# EAGLE schematic WiiSPii_Rev1.4 (EAGLE 9.6.2)

## Sheet 1 of 4: BQ25895M
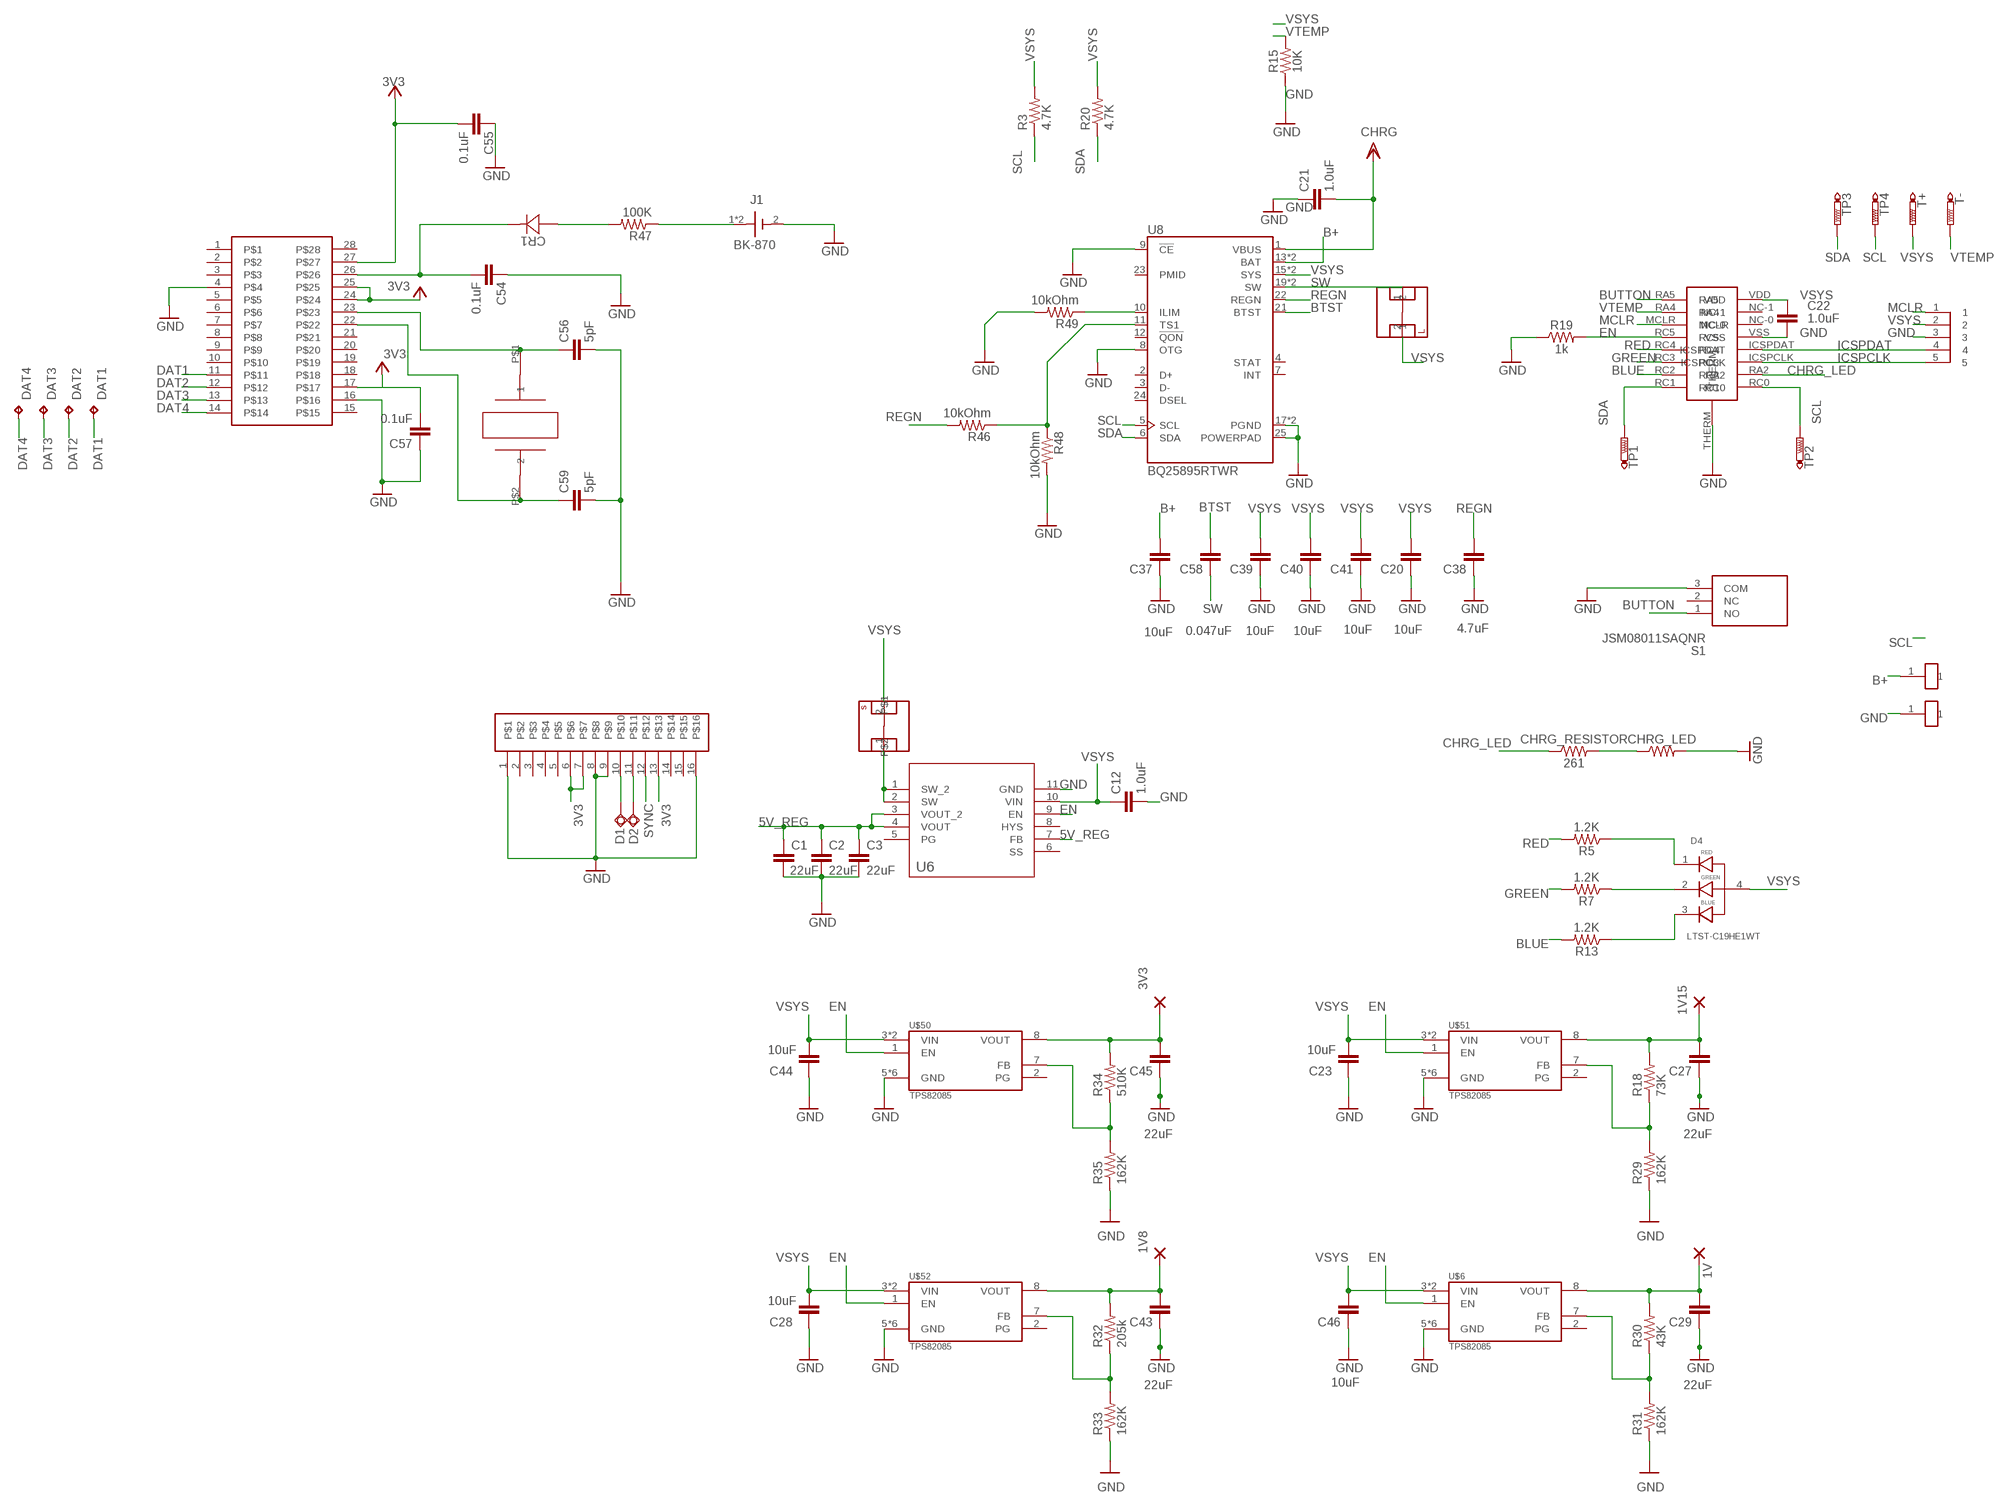
[diagram p0: schematic, sheet 1]

### Parts
1V  SMD2  [SMD1,27-2,54]
1V8  SMD2  [SMD1,27-2,54]
1V15  SMD2  [SMD1,27-2,54]
3V3  SMD2  [SMD1,27-2,54]
BT_DATA1  TPSQB1,27  [B1,27]
BT_DATA2  TPSQB1,27  [B1,27]
C1  22uF  1.0UF-0805-25V-(+80/-20%)  [0805]
C2  22uF  1.0UF-0805-25V-(+80/-20%)  [0805]
C3  22uF  1.0UF-0805-25V-(+80/-20%)  [0805]
C12  1.0uF  1.0UF-0805-25V-(+80/-20%)  [0805]
C20  10uF  1.0UF-0805-25V-(+80/-20%)  [0805]
C21  1.0uF  1.0UF-0805-25V-(+80/-20%)  [0805]
C22  1.0uF  1.0UF-0805-25V-(+80/-20%)  [0805]
C23  10uF  1.0UF-0805-25V-(+80/-20%)  [0805]
C27  22uF  1.0UF-0805-25V-(+80/-20%)  [0805]
C28  10uF  1.0UF-0805-25V-(+80/-20%)  [0805]
C29  22uF  1.0UF-0805-25V-(+80/-20%)  [0805]
C37  10uF  1.0UF-0805-25V-(+80/-20%)  [0805]
C38  4.7uF  C-EUC0402  [C0402]
C39  10uF  1.0UF-0805-25V-(+80/-20%)  [0805]
C40  10uF  1.0UF-0805-25V-(+80/-20%)  [0805]
C41  10uF  1.0UF-0805-25V-(+80/-20%)  [0805]
C43  22uF  1.0UF-0805-25V-(+80/-20%)  [0805]
C44  10uF  1.0UF-0805-25V-(+80/-20%)  [0805]
C45  22uF  1.0UF-0805-25V-(+80/-20%)  [0805]
C46  10uF  1.0UF-0805-25V-(+80/-20%)  [0805]
C54  0.1uF  C-EUC0402  [C0402]
C55  0.1uF  C-EUC0402  [C0402]
C56  5pF  C-EUC0402  [C0402]
C57  0.1uF  C-EUC0402  [C0402]
C58  0.047uF  C-EUC0402  [C0402]
C59  5pF  C-EUC0402  [C0402]
CHRG_LED  261  1KOHM-0603-1/10W-1%  [0603]
CHRG_RESISTOR  261  1KOHM-0603-1/10W-1%  [0603]
CR1  BAT60JFILM  [SOD-323_STM]
D4  LTST-C19HE1WT  [LED_LTST-C19HE1WT]
DAT1  TPB1,27  [B1,27]
DAT2  TPB1,27  [B1,27]
DAT3  TPB1,27  [B1,27]
DAT4  TPB1,27  [B1,27]
J1  BK-870  [MPD_BK-870]
R3  4.7K  R-US_R0402  [R0402]
R5  1.2K  1KOHM-0603-1/10W-1%  [0603]
R7  1.2K  1KOHM-0603-1/10W-1%  [0603]
R13  1.2K  1KOHM-0603-1/10W-1%  [0603]
R15  10K  1KOHM-0603-1/10W-1%  [0603]
R18  73K  R-US_R0402  [R0402]
R19  1k  1KOHM-0603-1/10W-1%  [0603]
R20  4.7K  R-US_R0402  [R0402]
R29  162K  R-US_R0402  [R0402]
R30  43K  R-US_R0402  [R0402]
R31  162K  R-US_R0402  [R0402]
R32  205k  R-US_R0402  [R0402]
R33  162K  R-US_R0402  [R0402]
R34  510K  R-US_R0402  [R0402]
R35  162K  R-US_R0402  [R0402]
R46  10kOhm  R-US_R0402  [R0402]
R47  100K  R-US_R0402  [R0402]
R48  10kOhm  R-US_R0402  [R0402]
R49  10kOhm  R-US_R0402  [R0402]
S1  JSM08011SAQNR  [JSM08011SAQNR]
T+  PTR1TP09R  [TP09R]
T-  PTR1TP09R  [TP09R]
TP1  PTR1TP09R  [TP09R]
TP2  PTR1TP09R  [TP09R]
TP3  PTR1TP09R  [TP09R]
TP4  PTR1TP09R  [TP09R]
U6  TPS61232DRCR  [DRC_S-PVSON-N10]
U8  BQ25895RTWR  [VQFN50P400X400X100-24N]
U$2  INDUCTOR_SMALL  [INDUCTOR_SMALL]
U$6  TPS82085  [SON65P280X300X133-9N]
U$7  AUDIO_AMP_PIC  [AUDIO_AMP_PIC]
U$8  1MM_PIC_PROGRAMING_HEADER  [1MM_PIC-PROGRAMING_HEADER]
U$13  MOLEX_0541020164MOLEX  [MOLEX_0541020164MOLEX]
U$14  MX_WII  [MX_WII]
U$15  TFE20  [TFE20]
U$27  VOLTAGE_PAD  [VOLTAGE_PAD]
U$28  VOLTAGE_PAD  [VOLTAGE_PAD]
U$49  INDUCTOR_LARGE  [INDUCTOR_BIG]
U$50  TPS82085  [SON65P280X300X133-9N]
U$51  TPS82085  [SON65P280X300X133-9N]
U$52  TPS82085  [SON65P280X300X133-9N]

### Nets
1V: 1V.1(P) C29.2 R30.2 U$6.8(VOUT)
1V8: 1V8.1(P) C43.2 R32.2 U$52.8(VOUT) ; also sheet 2
1V15: 1V15.1(P) C27.2 R18.2 U$51.8(VOUT)
3V3: 3V3.1(P) C45.2 C55.2 C57.2 R34.2 U$13.6 U$13.7 U$13.13 U$14.17 U$14.24 U$14.25 U$14.27 U$50.8(VOUT) ; supply symbol labelled VCC ; also sheet 2,4
5V_REG: C1.1 C2.1 C3.1 U6.3(VOUT_2) U6.4(VOUT) U6.7(FB) ; also sheet 3,4
B+: C37.2 U8.13(BAT) U8.14(BAT) U$28.1
BLUE: R13.2 U$7.RC2
BTST: C58.2 U8.21(BTST)
BUTTON: S1.1(NO) U$7.RA5
CHRG: C21.2 U8.1(VBUS) ; supply symbol labelled VDD ; also sheet 3
CHRG_LED: CHRG_RESISTOR.1 U$7.RA2
D1: BT_DATA1.TP U$13.10
D2: BT_DATA2.TP U$13.11
DAT1: DAT1.TP U$14.11
DAT2: DAT2.TP U$14.12
DAT3: DAT3.TP U$14.13
DAT4: DAT4.TP U$14.14
EN: R19.2 U6.9(EN) U$6.1(EN) U$7.RC5 U$50.1(EN) U$51.1(EN) U$52.1(EN)
GND: C1.2 C2.2 C3.2 C12.2 C20.1 C21.1 C22.2 C23.1 C27.1 C28.1 C29.1 C37.1 C38.1 C39.1 C40.1 C41.1 C43.1 C44.1 C45.1 C46.1 C54.1 C55.1 C56.2 C57.1 C59.2 CHRG_LED.2 J1.2(M) R15.1 R19.1 R29.1 R31.1 R33.1 R35.1 R48.2 R49.2 S1.3(COM) U6.11(GND) U8.8(OTG) U8.9(!CE) U8.17(PGND) U8.18(PGND) U8.25(POWERPAD) U$6.5(GND) U$6.6(GND) U$6.9(GND) U$6.P$1(GND) U$6.P$2(GND) U$6.P$3(GND) U$7.THERM U$7.VSS U$8.3 U$13.1 U$13.8 U$13.9 U$13.16 U$14.4 U$14.16 U$27.1 U$50.5(GND) U$50.6(GND) U$50.9(GND) U$50.P$1(GND) U$50.P$2(GND) U$50.P$3(GND) U$51.5(GND) U$51.6(GND) U$51.9(GND) U$51.P$1(GND) U$51.P$2(GND) U$51.P$3(GND) U$52.5(GND) U$52.6(GND) U$52.9(GND) U$52.P$1(GND) U$52.P$2(GND) U$52.P$3(GND) ; also sheet 2,3,4
GREEN: R7.2 U$7.RC3
ICSPCLK: U$7.ICSPCLK U$8.5
ICSPDAT: U$7.ICSPDAT U$8.4
MCLR: U$7.MCLR U$8.1
N$3: U6.1(SW_2) U6.2(SW) U$2.1
N$5: D4.2 R7.1
N$11: D4.1 R5.1
N$12: D4.3 R13.1
N$13: CHRG_LED.1 CHRG_RESISTOR.2
N$14: C56.1 U$14.23 U$15.P$1
N$15: C59.1 U$14.22 U$15.P$2
N$19: CR1.2 R47.2
N$27: R18.1 R29.2 U$51.7(FB)
N$28: R46.1 R48.1 U8.11(TS1)
N$29: R49.1 U8.10(ILIM)
N$34: C54.2 CR1.1 U$14.26
N$36: J1.1(P) J1.3(P) R47.1
N$53: R30.1 R31.2 U$6.7(FB)
N$55: R32.1 R33.2 U$52.7(FB)
N$57: R34.1 R35.2 U$50.7(FB)
RED: R5.2 U$7.RC4
REGN: C38.2 R46.2 U8.22(REGN)
SCL: R3.1 TP2.TP TP4.TP U8.5(SCL) U$7.RC0 ; also sheet 3
SDA: R20.1 TP1.TP TP3.TP U8.6(SDA) U$7.RC1 ; also sheet 3
SW: C58.1 U8.19(SW) U8.20(SW) U$49.1
SYNC: U$13.12 ; also sheet 4
VSYS: C12.1 C20.2 C22.1 C23.2 C28.2 C39.2 C40.2 C41.2 C44.2 C46.2 D4.4 R3.2 R20.2 T+.TP U6.10(VIN) U8.15(SYS) U8.16(SYS) U$2.2 U$6.3(VIN) U$6.4(VIN) U$7.VDD U$8.2 U$49.2 U$50.3(VIN) U$50.4(VIN) U$51.3(VIN) U$51.4(VIN) U$52.3(VIN) U$52.4(VIN) ; also sheet 3
VTEMP: R15.2 T-.TP U$7.RA4
Unconnected: S1.2(NC) U6.5(PG) U6.6(SS) U6.8(HYS) U8.2(D+) U8.3(D-) U8.4(STAT) U8.7(INT) U8.12(!QON) U8.23(PMID) U8.24(DSEL) U$6.2(PG) U$7.NC-0 U$7.NC-1 U$13.2 U$13.3 U$13.4 U$13.5 U$13.14 U$13.15 U$14.1 U$14.2 U$14.3 U$14.5 U$14.6 U$14.7 U$14.8 U$14.9 U$14.10 U$14.15 U$14.18 U$14.19 U$14.20 U$14.21 U$14.28 U$50.2(PG) U$51.2(PG) U$52.2(PG)

## Sheet 2 of 4: LM49450
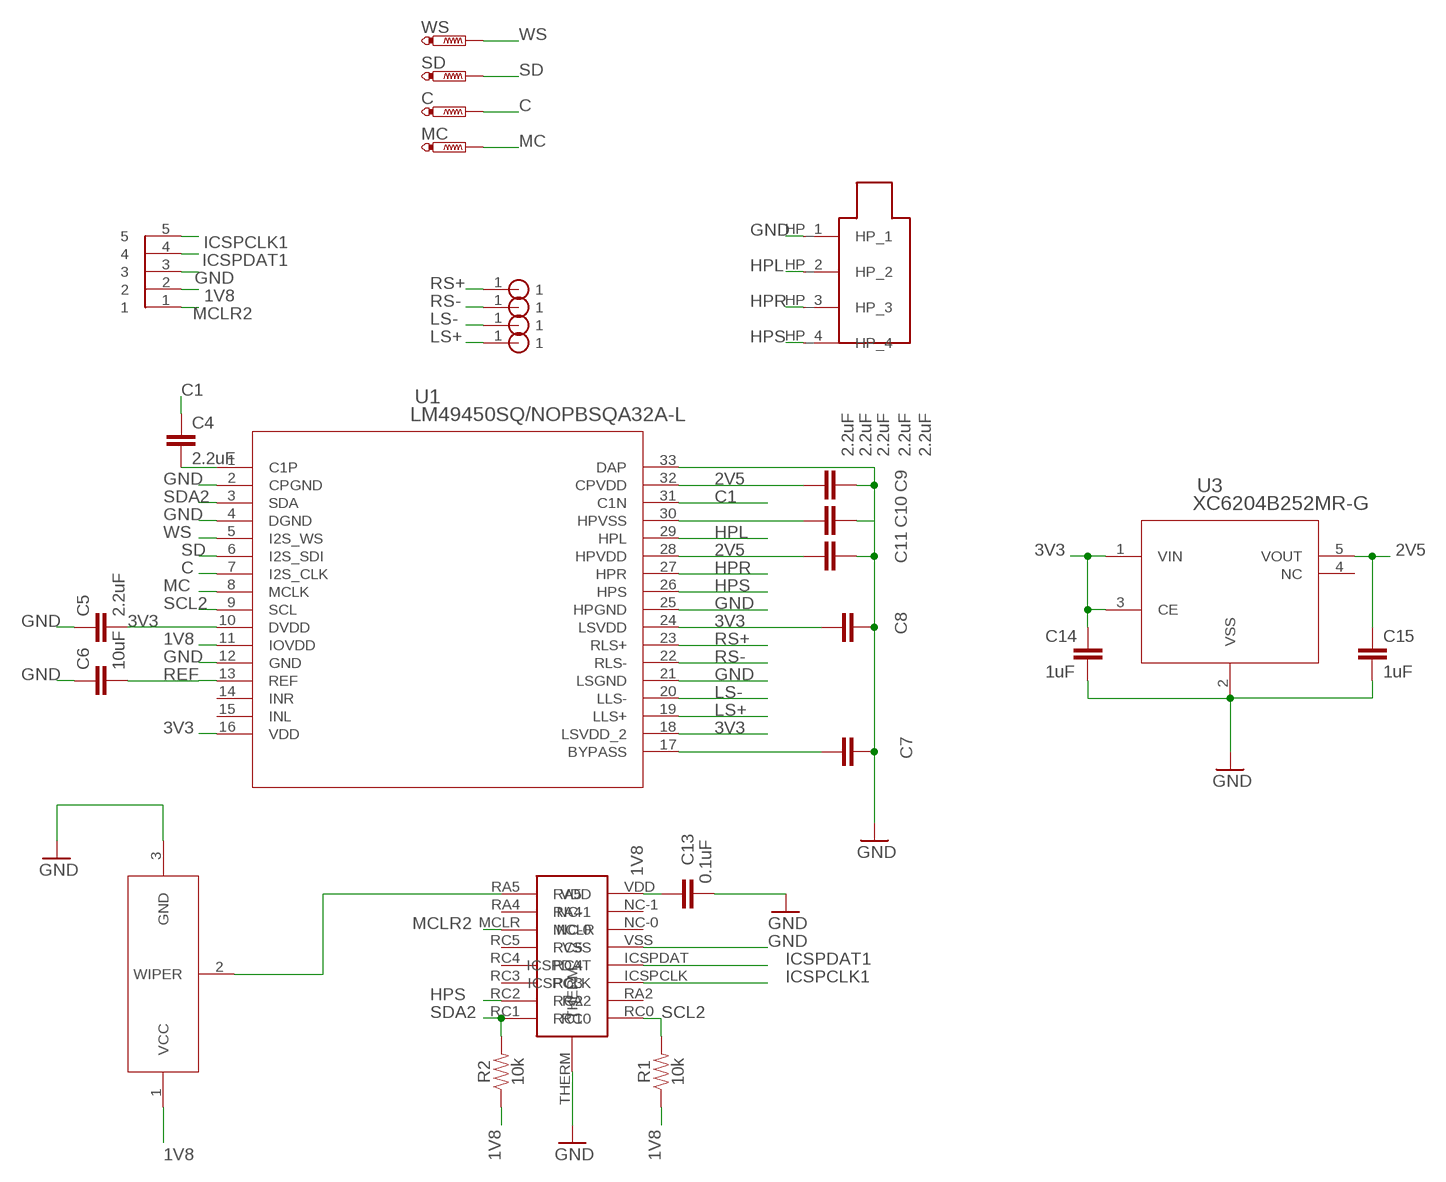
[diagram p1: schematic, sheet 2]

### Parts
C  PTR1TP09R  [TP09R]
C4  2.2uF  0.1UF-0603-100V-10%  [0603]
C5  2.2uF  0.1UF-0603-100V-10%  [0603]
C6  10uF  0.1UF-0603-100V-10%  [0603]
C7  2.2uF  0.1UF-0603-100V-10%  [0603]
C8  2.2uF  0.1UF-0603-100V-10%  [0603]
C9  2.2uF  0.1UF-0603-100V-10%  [0603]
C10  2.2uF  0.1UF-0603-100V-10%  [0603]
C11  2.2uF  0.1UF-0603-100V-10%  [0603]
C13  0.1uF  0.1UF-0603-100V-10%  [0603]
C14  1uF  0.1UF-0603-100V-10%  [0603]
C15  1uF  0.1UF-0603-100V-10%  [0603]
MC  PTR1TP09R  [TP09R]
R1  10k  1KOHM-0603-1/10W-1%  [0603]
R2  10k  1KOHM-0603-1/10W-1%  [0603]
RS+  WII_VIA  [WII_VIA]
SD  PTR1TP09R  [TP09R]
U1  LM49450SQ/NOPBSQA32A-L  [SQA32A-L]
U3  XC6204B252MR-G  [XC6204/05_SOT-25]
U$1  AUDIO_AMP_PIC  [AUDIO_AMP_PIC]
U$3  1MM_PIC_PROGRAMING_HEADER  [1MM_PIC-PROGRAMING_HEADER]
U$9  RK10J11R001Y  [RK10J11R001Y]
U$40  WII_VIA  [WII_VIA]
U$41  WII_VIA  [WII_VIA]
U$42  WII_VIA  [WII_VIA]
U$44  HP_JACK  [HP_JACK]
WS  PTR1TP09R  [TP09R]

### Nets
1V8: C13.1 R1.1 R2.1 U1.11(IOVDD) U$1.VDD U$3.2 U$9.1(VCC) ; also sheet 1
2V5: C9.1 C11.1 C15.1 U1.28(HPVDD) U1.32(CPVDD) U3.5(VOUT)
3V3: C5.2 C8.2 C14.1 U1.10(DVDD) U1.16(VDD) U1.18(LSVDD_2) U1.24(LSVDD) U3.1(VIN) U3.3(CE) ; also sheet 1,4
C: C.TP U1.7(I2S_CLK)
C1: C4.1 U1.31(C1N)
GND: C5.1 C6.1 C7.1 C8.1 C9.2 C10.2 C11.2 C13.2 C14.2 C15.2 U1.2(CPGND) U1.4(DGND) U1.12(GND) U1.21(LSGND) U1.25(HPGND) U1.33(DAP) U3.2(VSS) U$1.THERM U$1.VSS U$3.3 U$9.3(GND) U$44.HP_1 ; also sheet 1,3,4
HPL: U1.29(HPL) U$44.HP_2
HPR: U1.27(HPR) U$44.HP_3
HPS: U1.26(HPS) U$1.RC2 U$44.HP_4
ICSPCLK1: U$1.ICSPCLK U$3.5
ICSPDAT1: U$1.ICSPDAT U$3.4
LS+: U1.19(LLS+) U$42.1
LS-: U1.20(LLS-) U$41.1
MC: MC.TP U1.8(MCLK)
MCLR2: U$1.MCLR U$3.1
N$1: C7.2 U1.17(BYPASS)
N$30: C10.1 U1.30(HPVSS)
N$35: U$1.RA5 U$9.2(WIPER)
PIN1: C4.2 U1.1(C1P)
REF: C6.2 U1.13(REF)
RS+: RS+.1 U1.23(RLS+)
RS-: U1.22(RLS-) U$40.1
SCL2: R1.2 U1.9(SCL) U$1.RC0
SD: SD.TP U1.6(I2S_SDI)
SDA2: R2.2 U1.3(SDA) U$1.RC1
WS: U1.5(I2S_WS) WS.TP
Unconnected: U1.14(INR) U1.15(INL) U3.4(NC) U$1.NC-0 U$1.NC-1 U$1.RA2 U$1.RA4 U$1.RC3 U$1.RC4 U$1.RC5

## Sheet 3 of 4: STUBS4500
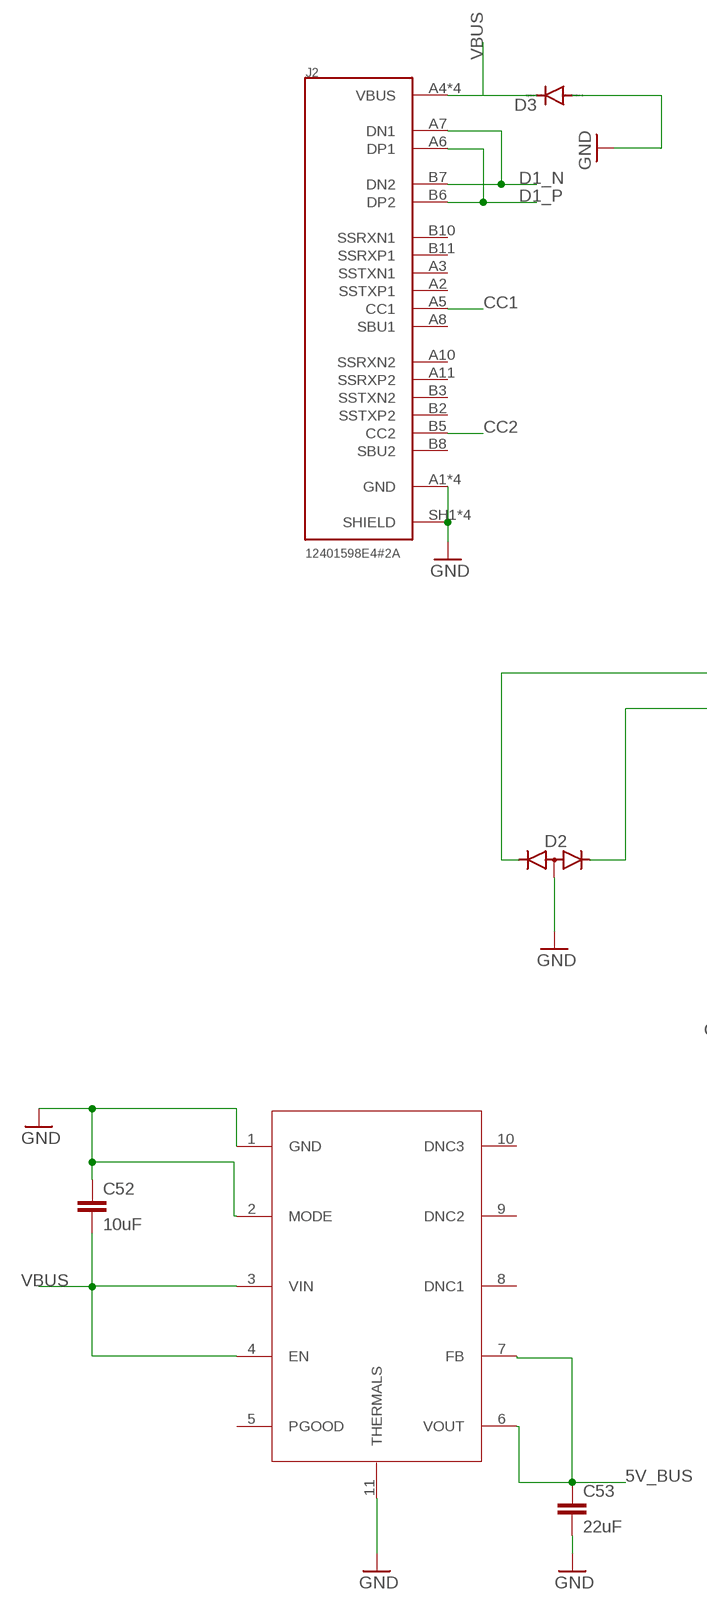
[diagram p2: schematic, sheet 3, part 1 of 2]
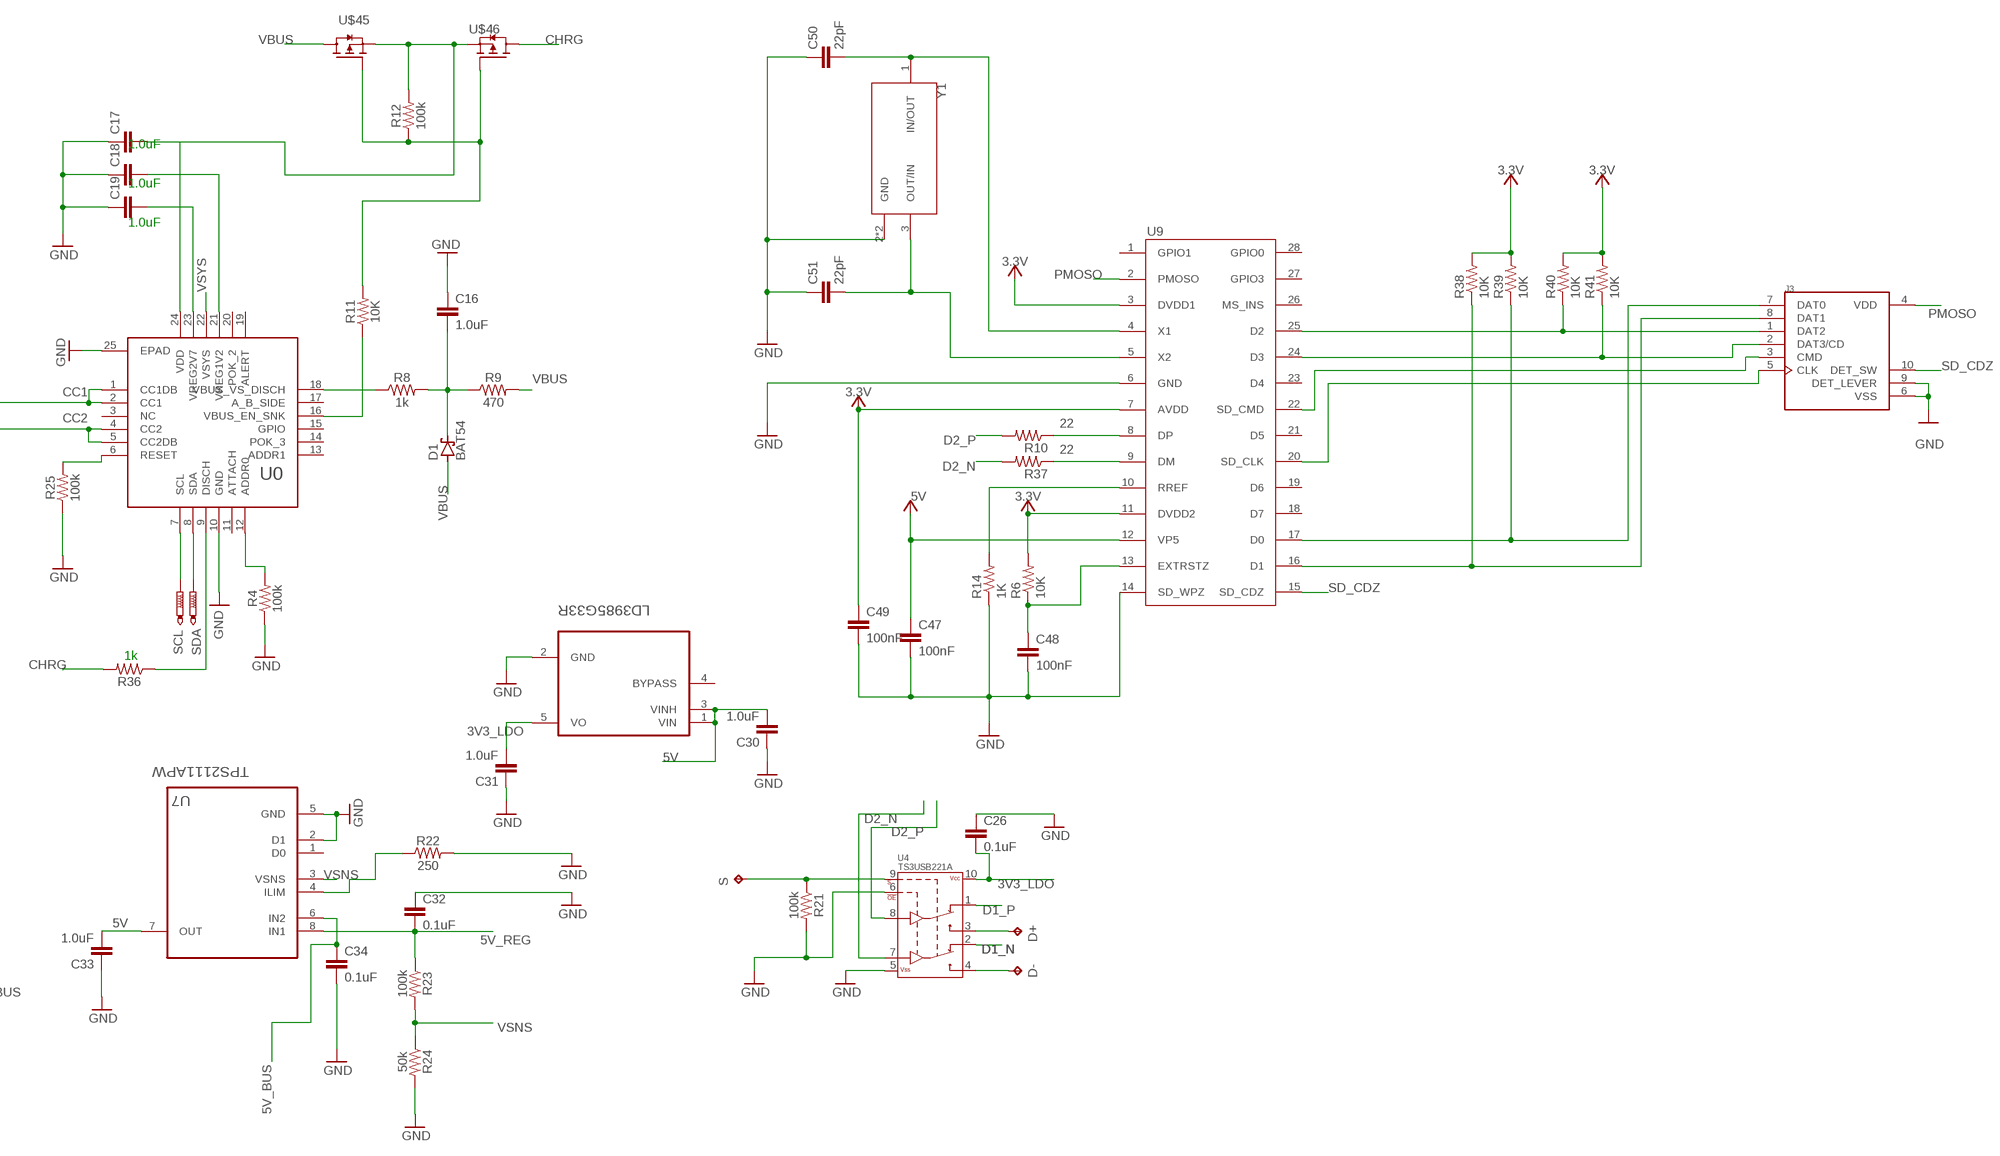
[diagram p3: schematic, sheet 3, part 2 of 2]

### Parts
C16  1.0uF  1.0UF-0603-16V-10%  [0603]
C17  1.0uF  1.0UF-0603-16V-10%  [0603]
C18  1.0uF  1.0UF-0603-16V-10%  [0603]
C19  1.0uF  1.0UF-0603-16V-10%  [0603]
C26  0.1uF  0.1UF-0603-25V-(+80/-20%)  [0603]
C30  1.0uF  1.0UF-0603-16V-10%  [0603]
C31  1.0uF  1.0UF-0603-16V-10%  [0603]
C32  0.1uF  0.1UF-0603-25V-(+80/-20%)  [0603]
C33  1.0uF  1.0UF-0603-16V-10%  [0603]
C34  0.1uF  0.1UF-0603-25V-(+80/-20%)  [0603]
C47  100nF  C-EUC0402  [C0402]
C48  100nF  C-EUC0402  [C0402]
C49  100nF  C-EUC0402  [C0402]
C50  22pF  C-EUC0402  [C0402]
C51  22pF  C-EUC0402  [C0402]
C52  10uF  22UF-1210-16V-20%  [1210]
C53  22uF  22UF-1210-16V-20%  [1210]
D1  BAT54  [SOT23]
D2  ESDA25W  [SOT65P210X110-3N]
D3  ESDA25P35-1U1M  [ESDA8P801U1M]
D+  TPB1,27  [B1,27]
D-  TPB1,27  [B1,27]
J2  12401598E4#2A  [AMPHENOL_12401598E4#2A]
J3  5025700893  [MOLEX_5025700893]
R4  100k  100KOHM-0603-1/10W-1%  [0603]
R6  10K  R-US_R0402  [R0402]
R8  1k  1KOHM-0603-1/10W-1%  [0603]
R9  470  470OHM-0603-1/10W-1%  [0603]
R10  22  R-US_R0402  [R0402]
R11  10K  22KOHM-0603-1/10W-1%  [0603]
R12  100k  100KOHM-0603-1/10W-1%  [0603]
R14  1K  R-US_R0402  [R0402]
R21  100k  100KOHM-0603-1/10W-1%  [0603]
R22  250  240OHM-0603-1/10W-1%  [0603]
R23  100k  240OHM-0603-1/10W-1%  [0603]
R24  50k  240OHM-0603-1/10W-1%  [0603]
R25  100k  100KOHM-0603-1/10W-1%  [0603]
R36  1K  100KOHM-0603-1/10W-1%  [0603]
R37  22  R-US_R0402  [R0402]
R38  10K  R-US_R0402  [R0402]
R39  10K  R-US_R0402  [R0402]
R40  10K  R-US_R0402  [R0402]
R41  10K  R-US_R0402  [R0402]
S  TPB1,27  [B1,27]
SCL  PTR1TP09R  [TP09R]
SDA  PTR1TP09R  [TP09R]
U0  STUSB4500  [QFN50P440X440X100-25T255]
U4  TS3USB221A  [QFN-10-RSE]
U5  LD3985G33R  [SOT95P280X145-5N]
U7  TPS2111APW  [SOP65P640X120-8N]
U9  GL82L_SSOP  [GL827L_SSOP]
U$10  LMZM23601  [MODULE_LMZM23600SILR]
U$45  STL6P3LLH6  [POWERFLAT_3.3X3.3]
U$46  STL6P3LLH6  [POWERFLAT_3.3X3.3]
Y1  ECS-120-13-30B-AEM-TR  [XTAL_ECS-120-13-30B-AEM-TR]

### Nets
3.3V: C49.1 R6.2 R38.2 R39.2 R40.2 R41.2 U9.3(DVDD1) U9.7(AVDD) U9.11(DVDD2) ; supply symbol labelled VCC
3V3_LDO: C26.2 C31.2 U4.10(VCC) U5.5(VO)
5V: C30.2 C33.2 C47.1 U5.1(VIN) U5.3(VINH) U7.7(OUT) U9.12(VP5) ; supply symbol labelled VCC
5V_BUS: C34.1 C53.1 U7.6(IN2) U$10.6(VOUT) U$10.7(FB)
5V_REG: C32.2 R23.1 U7.8(IN1) ; also sheet 1,4
CC1: D2.1(K2) J2.A5(CC1) U0.1(CC1DB) U0.2(CC1)
CC2: D2.2(K1) J2.B5(CC2) U0.4(CC2) U0.5(CC2DB)
CHRG: R36.2 U$46.5(D) U$46.6(D) U$46.7(D) ; also sheet 1
D1_N [USB 2.0 Differential Pair]: J2.A7(DN1) J2.B7(DN2) U4.2(1D-)
D1_P [USB 2.0 Differential Pair]: J2.A6(DP1) J2.B6(DP2) U4.1(1D+)
D2_N [USB 2.0 Differential Pair]: R37.2 U4.7(D-)
D2_P [USB 2.0 Differential Pair]: R10.2 U4.8(D+)
GND: C16.1 C17.1 C18.1 C19.1 C26.1 C30.1 C31.1 C32.1 C33.1 C34.2 C47.2 C48.2 C49.2 C50.1 C51.1 C52.1 C53.2 D2.3(A) D3.1(A) J2.A1(GND) J2.A12(GND) J2.B1(GND) J2.B12(GND) J2.SH1(SHIELD) J2.SH2(SHIELD) J2.SH3(SHIELD) J2.SH4(SHIELD) J3.6(VSS) J3.9(DET_LEVER) R4.1 R14.1 R21.2 R22.2 R24.2 R25.1 U0.10(GND) U0.25(EPAD) U4.5(VSS) U4.6(!OE) U5.2(GND) U7.2(D1) U7.5(GND) U9.6(GND) U9.14(SD_WPZ) U$10.1(GND) U$10.2(MODE) U$10.11(THERMALS) Y1.2(GND) Y1.4(GND) ; also sheet 1,2,4
N$6: R4.2 U0.12(ADDR0)
N$7: R8.1 U0.18(VBUS_VS_DISCH)
N$8: C19.2 U0.23(VREG2V7)
N$9: R11.1 U0.16(VBUS_EN_SNK)
N$10: R11.2 R12.1 U$45.4(G) U$46.4(G)
N$16: R36.1 U0.9(DISCH)
N$20: R21.1 S.TP U4.9(S)
N$21: D-.TP U4.4(2D-)
N$22: D+.TP U4.3(2D+)
N$23: R22.1 U7.4(ILIM)
N$24: R25.2 U0.6(RESET)
N$25: C18.2 U0.21(VREG1V2)
N$26: C16.2 D1.3(C) R8.2 R9.1
N$31: C48.1 R6.1 U9.13(EXTRSTZ)
N$52: R14.2 U9.10(RREF)
N$54: R10.1 U9.8(DP)
N$56: R37.1 U9.9(DM)
N$68: C50.2 U9.4(X1) Y1.1(IN/OUT)
N$69: J3.1(DAT2) R40.1 U9.25(D2)
N$70: J3.2(DAT3/CD) R41.1 U9.24(D3)
N$71: J3.3(CMD) U9.22(SD_CMD)
N$73: J3.5(CLK) U9.20(SD_CLK)
N$74: J3.8(DAT1) R38.1 U9.16(D1)
N$75: J3.7(DAT0) R39.1 U9.17(D0)
N$76: C51.2 U9.5(X2) Y1.3(OUT/IN)
PMOSO: J3.4(VDD) U9.2(PMOSO)
SCL: SCL.TP U0.7(SCL) ; also sheet 1
SD_CDZ: J3.10(DET_SW) U9.15(SD_CDZ)
SDA: SDA.TP U0.8(SDA) ; also sheet 1
VBUS: C52.2 D1.1(A) D3.2(C) J2.A4(VBUS) J2.A9(VBUS) J2.B4(VBUS) J2.B9(VBUS) R9.2 U$10.3(VIN) U$10.4(EN) U$45.5(D) U$45.6(D) U$45.7(D)
VCC: C17.2 R12.2 U0.24(VDD) U$45.1(S) U$45.2(S) U$45.3(S) U$46.1(S) U$46.2(S) U$46.3(S) ; also sheet 1
VSNS: R23.2 R24.1 U7.3(VSNS)
VSYS: U0.22(VSYS) ; also sheet 1
Unconnected: J2.A2(SSTXP1) J2.A3(SSTXN1) J2.A8(SBU1) J2.A10(SSRXN2) J2.A11(SSRXP2) J2.B2(SSTXP2) J2.B3(SSTXN2) J2.B8(SBU2) J2.B10(SSRXN1) J2.B11(SSRXP1) U0.3(NC) U0.11(ATTACH) U0.13(ADDR1) U0.14(POK_3) U0.15(GPIO) U0.17(A_B_SIDE) U0.19(ALERT) U0.20(POK_2) U5.4(BYPASS) U7.1(D0) U9.1(GPIO1) U9.18(D7) U9.19(D6) U9.21(D5) U9.23(D4) U9.26(MS_INS) U9.27(GPIO3) U9.28(GPIO0) U$10.5(PGOOD) U$10.8(DNC1) U$10.9(DNC2) U$10.10(DNC3)

### Notes on the sheet
- 1.0uF
- 1.0uF
- 1.0uF
- 1k

## Sheet 4 of 4: GC+ 2.0
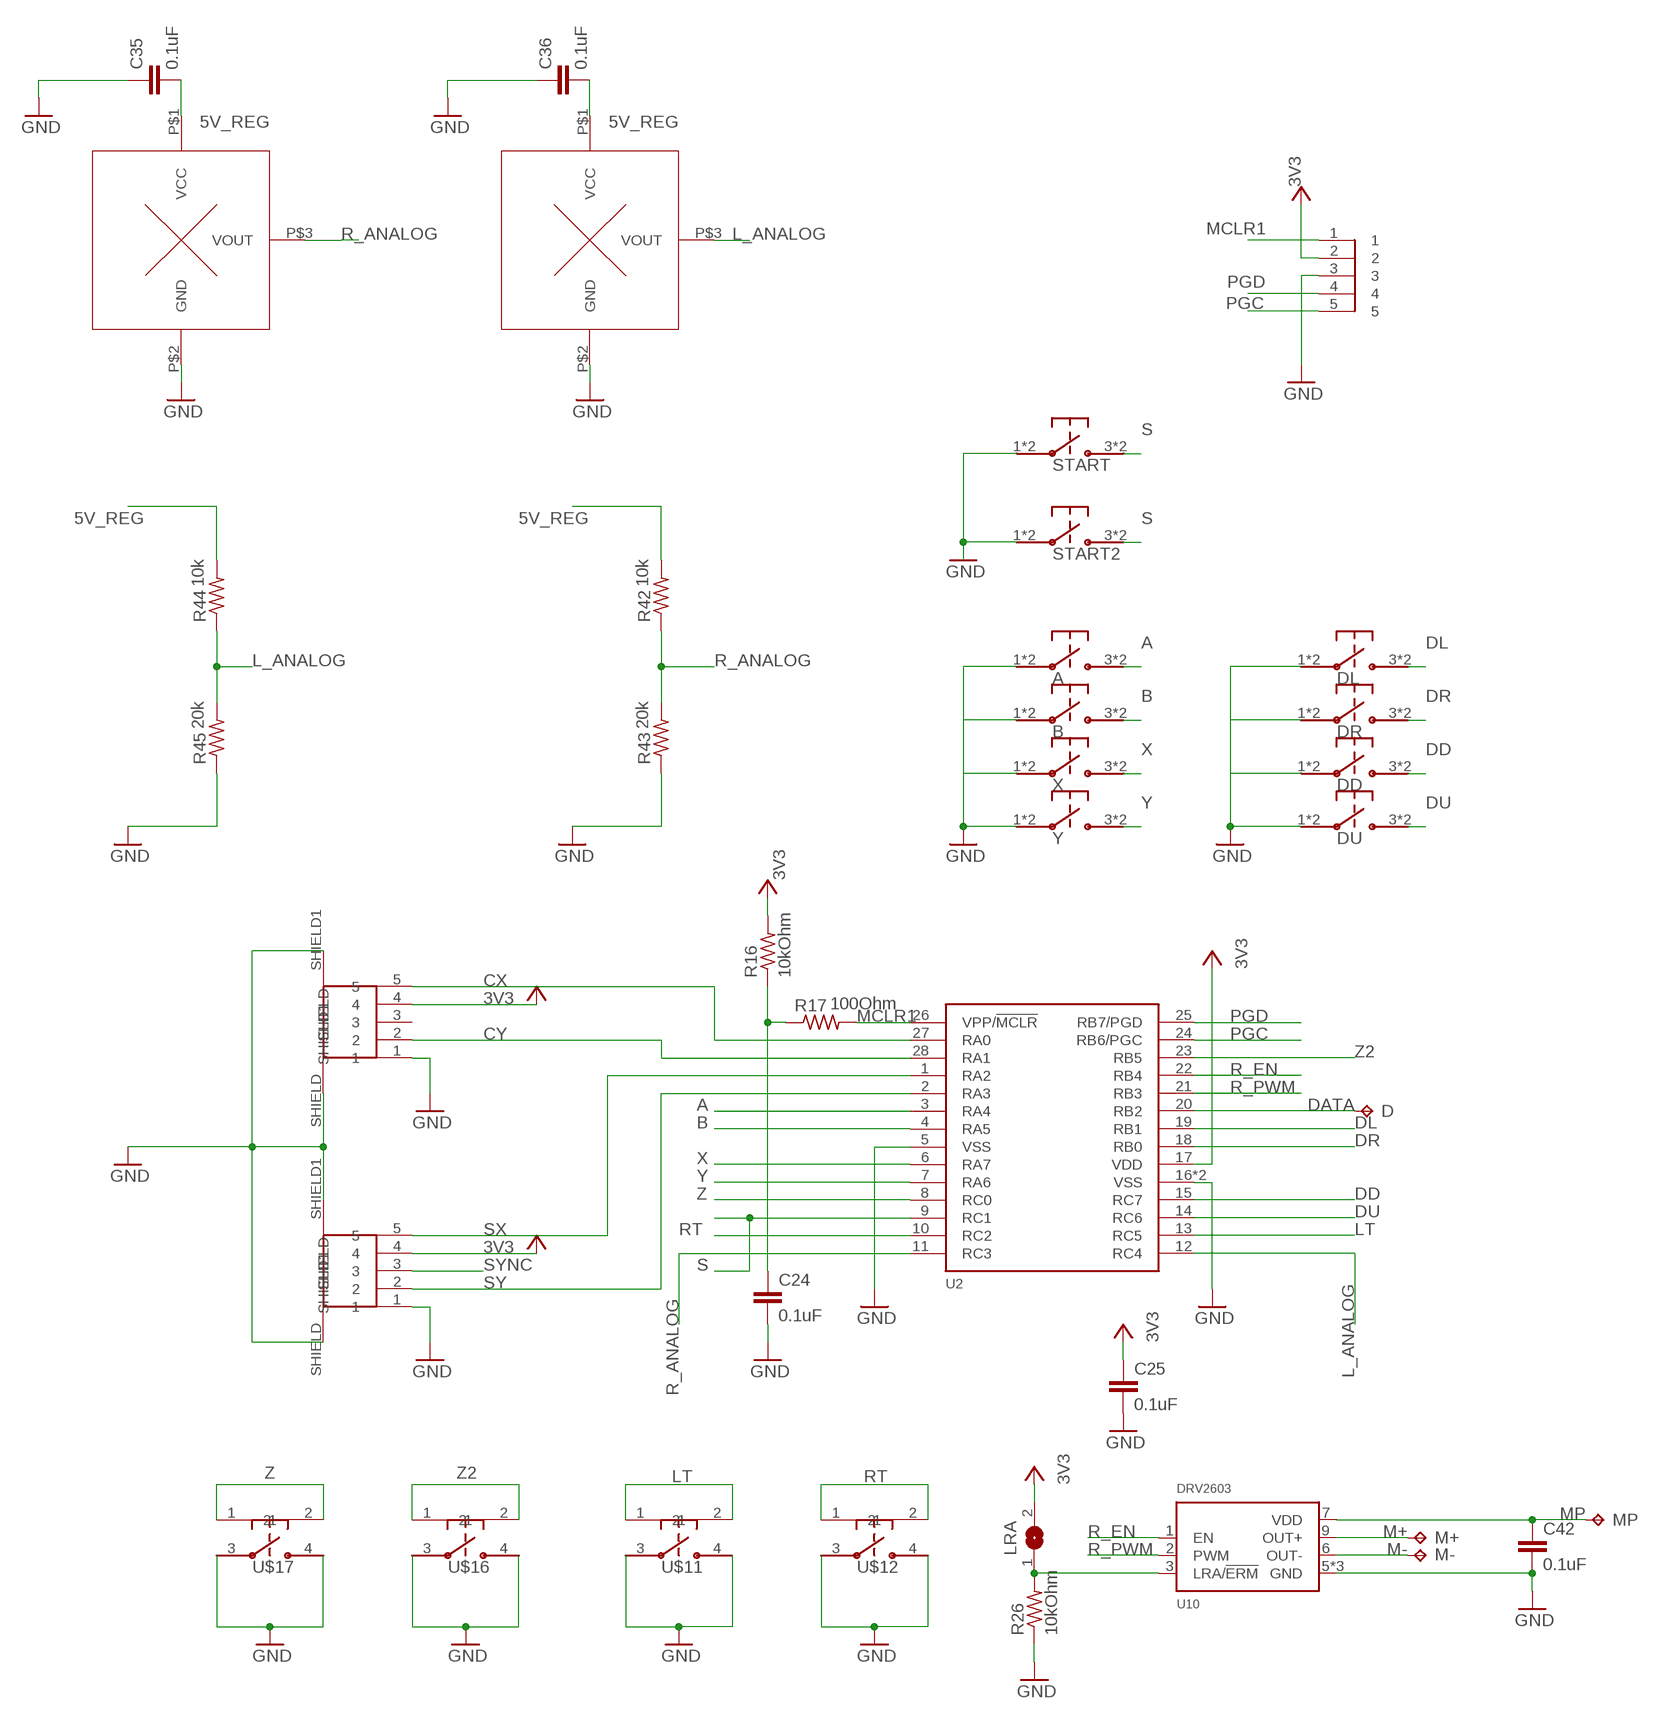
[diagram p4: schematic, sheet 4]

### Parts
A  TL3315NF100Q  [TL3315NF100Q]
B  TL3315NF100Q  [TL3315NF100Q]
C24  0.1uF  C-EUC0402  [C0402]
C25  0.1uF  C-EUC0402  [C0402]
C35  0.1uF  C-EUC0402  [C0402]
C36  0.1uF  C-EUC0402  [C0402]
C42  0.1uF  C-EUC0402  [C0402]
DATA  TPTP10SQ  [TP10SQ]
DD  TL3315NF100Q  [TL3315NF100Q]
DL  TL3315NF100Q  [TL3315NF100Q]
DR  TL3315NF100Q  [TL3315NF100Q]
DU  TL3315NF100Q  [TL3315NF100Q]
HS1  MLX90290  [MLX90290]
HS2  MLX90290  [MLX90290]
LRA  SJ  [SJ]
M+  TPTP10SQ  [TP10SQ]
M-  TPTP10SQ  [TP10SQ]
MP  TPTP10SQ  [TP10SQ]
R16  10kOhm  R-US_R0402  [R0402]
R17  100Ohm  R-US_R0402  [R0402]
R26  10kOhm  R-US_R0402  [R0402]
R42  10k  R-US_R0402  [R0402]
R43  20k  R-US_R0402  [R0402]
R44  10k  R-US_R0402  [R0402]
R45  20k  R-US_R0402  [R0402]
START  TL3315NF100Q  [TL3315NF100Q]
START2  TL3315NF100Q  [TL3315NF100Q]
U2  PIC18F25K42  [QFN-28]
U10  DRV2603  [WQFN-10]
U$4  SWITCHSTICK_BREAKOUT  [SWITCHSTICK_BREAKOUT]
U$5  SWITCHSTICK_BREAKOUT  [SWITCHSTICK_BREAKOUT]
U$11  EVQ-P7J01P  [EVQ-P7J01P]
U$12  EVQ-P7J01P  [EVQ-P7J01P]
U$16  EVQ-P7J01P  [EVQ-P7J01P]
U$17  EVQ-P7J01P  [EVQ-P7J01P]
U$18  1MM_PIC_PROGRAMING_HEADER  [1MM_PIC-PROGRAMING_HEADER]
X  TL3315NF100Q  [TL3315NF100Q]
Y  TL3315NF100Q  [TL3315NF100Q]

### Nets
3V3: C25.1 LRA.2 R16.2 U2.17(VDD) U$4.4 U$5.4 U$18.2 ; supply symbol labelled +3V3, VCC ; also sheet 1,2
5V_REG: C35.2 C36.2 HS1.P$1(VCC) HS2.P$1(VCC) R42.2 R44.2 ; also sheet 1,3
A: A.3 A.4 U2.3(RA4)
B: B.3 B.4 U2.4(RA5)
CX: U2.27(RA0) U$5.5
CY: U2.28(RA1) U$5.2
DD: DD.3 DD.4 U2.15(RC7)
DL: DL.3 DL.4 U2.19(RB1)
DR: DR.3 DR.4 U2.18(RB0)
DU: DU.3 DU.4 U2.14(RC6)
GND: A.1 A.2 B.1 B.2 C24.2 C25.2 C35.1 C36.1 C42.2 DD.1 DD.2 DL.1 DL.2 DR.1 DR.2 DU.1 DU.2 HS1.P$2(GND) HS2.P$2(GND) R26.1 R43.1 R45.1 START2.1 START2.2 START.1 START.2 U2.5(VSS) U2.16(VSS) U2.PAD(VSS) U10.5(GND) U10.8(GND) U10.10(GND) U$4.1 U$4.SHIELD U$4.SHIELD1 U$5.1 U$5.SHIELD U$5.SHIELD1 U$11.3 U$11.4 U$12.3 U$12.4 U$16.3 U$16.4 U$17.3 U$17.4 U$18.3 X.1 X.2 Y.1 Y.2 ; also sheet 1,2,3
L_ANALOG: HS2.P$3(VOUT) R44.1 R45.2 U2.12(RC4)
LT: U2.13(RC5) U$11.1 U$11.2
M+: M+.TP U10.9(OUT+)
M-: M-.TP U10.6(OUT-)
MCLR1: R17.2 U2.26(VPP/!MCLR) U$18.1
MP: C42.1 MP.TP U10.7(VDD)
N$18: LRA.1 R26.2 U10.3(LRA/!ERM)
N$44: DATA.TP U2.20(RB2)
N$46: C24.1 R16.1 R17.1
PGC: U2.24(RB6/PGC) U$18.5
PGD: U2.25(RB7/PGD) U$18.4
R_ANALOG: HS1.P$3(VOUT) R42.1 R43.2 U2.11(RC3)
R_EN: U2.22(RB4) U10.1(EN)
R_PWM: U2.21(RB3) U10.2(PWM)
RT: U2.10(RC2) U$12.1 U$12.2
S: START2.3 START2.4 START.3 START.4 U2.9(RC1)
SX: U2.1(RA2) U$4.5
SY: U2.2(RA3) U$4.2
SYNC: U$4.3 ; also sheet 1
X: U2.6(RA7) X.3 X.4
Y: U2.7(RA6) Y.3 Y.4
Z: U2.8(RC0) U$17.1 U$17.2
Z2: U2.23(RB5) U$16.1 U$16.2
Unconnected: U$5.3

## Library data of the parts
1V 1V8 1V15 3V3 = wirepad:SMD2: SMD PAD
A B DD DL DR DU START START2 X Y = TL3315NF100Q:TL3315NF100Q: SWITCH TACTILE SPST-NO 0.05A 15V Check prices; AVAILABILITY: Warning; DESCRIPTION: Tactile Switch SPST-NO Top Actuated Surface Mount; DIGIKEY-PURCHASE-URL: https://snapeda.com/shop?store=DigiKey&id=289310; MF: E-Switch; MOUSER-PURCHASE-URL: https://snapeda.com/shop?store=Mouser&id=289310; MP: TL3315NF100Q; PACKAGE: None; PRICE: None
BT_DATA1 BT_DATA2 = testpad:TPSQ: Test pad
C MC SCL SD SDA T+ T- TP1-TP4 WS = testpad:PTR1: TEST PIN
C1-C3 C20 C23 C27-C29 C37 C39-C41 C43-C46 = SparkFun-Capacitors:1.0UF: 1µF ceramic capacitors A capacitor is a passive two-terminal electrical component used to store electrical energy temporarily in an electric field.; PROD_ID: CAP-11625; VALUE: 1.0uF
C4-C11 C14 C15 = SparkFun-Capacitors:0.1UF: 0.1µF ceramic capacitors A capacitor is a passive two-terminal electrical component used to store electrical energy temporarily in an electric field.; PROD_ID: CAP-08390; VALUE: 0.1uF
C12 C21 C22 = SparkFun-Capacitors:1.0UF: 1µF ceramic capacitors A capacitor is a passive two-terminal electrical component used to store electrical energy temporarily in an electric field.; PROD_ID: CAP-11625
C13 = SparkFun-Capacitors:0.1UF: 0.1µF ceramic capacitors A capacitor is a passive two-terminal electrical component used to store electrical energy temporarily in an electric field.; PROD_ID: CAP-08390
C16-C19 C30 C31 C33 = USB Board:1.0UF: 1µF ceramic capacitors A capacitor is a passive two-terminal electrical component used to store electrical energy temporarily in an electric field.; PROD_ID: CAP-00868
C24 C25 C35 C36 C38 C42 C47-C51 C54-C59 = resistor:C-EU: CAPACITOR, European symbol
C26 C32 C34 = SparkFun-Capacitors:0.1UF: 0.1µF ceramic capacitors A capacitor is a passive two-terminal electrical component used to store electrical energy temporarily in an electric field.; PROD_ID: CAP-00810
C52 C53 = SparkFun-Capacitors:22UF: 22µF ceramic capacitors A capacitor is a passive two-terminal electrical component used to store electrical energy temporarily in an electric field.
CHRG_LED CHRG_RESISTOR R1 R2 R5 R7 R13 R15 = SparkFun-Resistors:1KOHM: 1kΩ resistor A resistor is a passive two-terminal electrical component that implements electrical resistance as a circuit element. Resistors act to reduce current flow, and, at the same time, act to lower voltage levels within circuits. - Wikipedia; PROD_ID: RES-07856; VALUE: 1k
CR1 = WiiSPii:BAT60JFILM; BUILT_BY: EMA_UL_Team; MANUFACTURER_PART_NUMBER: BAT60JFILM; SOURCELIBRARY: StMicro_2011-06-07; VENDOR: STMicroelectronics
D1 = diode:BAT54: Schottky Diodes Source: Fairchild .. BAT54.pdf
D2 = samacsys:ESDA25W: STMicroelectronics ESDA25W Dual Uni-Directional TVS Diode Array, 400W peak, 3-Pin SOT-323 Source: Datasheet; DESCRIPTION: STMicroelectronics ESDA25W Dual Uni-Directional TVS Diode Array, 400W peak, 3-Pin SOT-323; HEIGHT: 1.1mm; MANUFACTURER_NAME: STMicroelectronics; MANUFACTURER_PART_NUMBER: ESDA25W; MOUSER_PART_NUMBER: 511-ESDA25W; MOUSER_PRICE-STOCK: https://www.mouser.com/Search/Refine.aspx?Keyword=511-ESDA25W; RS_PART_NUMBER: 0250101; RS_PRICE-STOCK: http://uk.rs-online.com/web/p/products/0250101
D3 = samacsys:ESDA25P35-1U1M: STMicroelectronics ESDA25P35-1U1M, Uni-Directional TVS Diode, 1400W, 2-Pin QFN Source: Datasheet; DESCRIPTION: STMicroelectronics ESDA25P35-1U1M, Uni-Directional TVS Diode, 1400W, 2-Pin QFN; HEIGHT: 0mm; MANUFACTURER_NAME: STMicroelectronics; MANUFACTURER_PART_NUMBER: ESDA25P35-1U1M; MOUSER_PART_NUMBER: 511-ESDA25P35-1U1M; MOUSER_PRICE-STOCK: https://www.mouser.com/Search/Refine.aspx?Keyword=511-ESDA25P35-1U1M; RS_PART_NUMBER: 1639774P; RS_PRICE-STOCK: http://uk.rs-online.com/web/p/products/1639774P
D4 = LTST-C19HE1WT:LTST-C19HE1WT: Red, Green, Blue (RGB) 624nm Red, 525nm Green, 470nm Blue LED Indication - Discrete 2.1V Red, 3.35V Green, 3.35V Blue 0606 (1616 Metric); DESCRIPTION: Red, Green, Blue (RGB) 624nm Red, 525nm Green, 470nm Blue LED Indication - Discrete 2.1V Red, 3.35V Green, 3.35V Blue 0606 (1616 Metric); DIGI-KEY_PART_NUMBER: 160-2162-1-ND; MF: Lite-On Inc.; MP: LTST-C19HE1WT; PACKAGE: 0606 Lite-On; PURCHASE-URL: https://pricing.snapeda.com/search/part/LTST-C19HE1WT/?ref=eda
D+ D- DAT1-DAT4 S = testpad:TP: Test pad
DATA = testpad:TP: Test pad; TP_SIGNAL_NAME: D
HS1 HS2 = My_Stuff:MLX90290
J1 = BK-870:BK-870: Battery Retainer Cr1025; DESCRIPTION: BATTERY RETAINER COIN 10MM SMD; MF: MPD (Memory Protection Devices); MP: BK-870; PACKAGE: None; PURCHASE-URL: https://pricing.snapeda.com/search/part/BK-870/?ref=eda
J2 = 12401598E4_2A:12401598E4#2A: Usb Jack 3.1, C Type, 24 Pin, Ho Check prices; AVAILABILITY: Warning; DESCRIPTION: USB-C (USB TYPE-C) USB 3.2 Gen 2 (USB 3.1 Gen 2, Superspeed + (USB 3.1)) Receptacle Connector 24 Position Surface Mount, Right Angle; Through Hole; MF: Amphenol ICC (Commercial Products); MP: 12401598E4#2A; PACKAGE: None; PRICE: None; PURCHASE-URL: https://pricing.snapeda.com/search/part/12401598E4#2A/?ref=eda
J3 = 5025700893:5025700893: 1.10mm Pitch microSD Memory Card Connector, Normal Mount Surface Mount, Push-Push Type; DESCRIPTION: 10 (8 + 2) Position Card Connector Secure Digital - microSD™ Surface Mount, Right Angle Gold; DIGI-KEY_PART_NUMBER: WM19093CT-ND; DIGIKEY-PURCHASE-URL: https://snapeda.com/shop?store=DigiKey&id=379523; MF: Molex; MP: 5025700893; PACKAGE: None
LRA = jumper:SJ: SMD solder JUMPER
M+ = testpad:TP: Test pad; TP_SIGNAL_NAME: M+
M- = testpad:TP: Test pad; TP_SIGNAL_NAME: M-
MP = testpad:TP: Test pad; TP_SIGNAL_NAME: MP
R3 R17 R18 R20 R26 R29-R35 R42-R45 = resistor:R-US_: RESISTOR, American symbol
R4 R12 R21 R25 = SparkFun-Resistors:100KOHM: 100kΩ resistor A resistor is a passive two-terminal electrical component that implements electrical resistance as a circuit element. Resistors act to reduce current flow, and, at the same time, act to lower voltage levels within circuits. - Wikipedia; PROD_ID: RES-07828
R6 R10 R14 R16 R37-R41 R46-R49 = resistor:R-US_: RESISTOR, American symbol; SPICEPREFIX: R
R8 R19 = SparkFun-Resistors:1KOHM: 1kΩ resistor A resistor is a passive two-terminal electrical component that implements electrical resistance as a circuit element. Resistors act to reduce current flow, and, at the same time, act to lower voltage levels within circuits. - Wikipedia; PROD_ID: RES-07856
R9 = SparkFun-Resistors:470OHM: 470Ω resistor A resistor is a passive two-terminal electrical component that implements electrical resistance as a circuit element. Resistors act to reduce current flow, and, at the same time, act to lower voltage levels within circuits. - Wikipedia; PROD_ID: RES-07869
R11 = SparkFun-Resistors:22KOHM: 22kΩ resistor A resistor is a passive two-terminal electrical component that implements electrical resistance as a circuit element. Resistors act to reduce current flow, and, at the same time, act to lower voltage levels within circuits. - Wikipedia; PROD_ID: RES-07853; VALUE: 22k
R22-R24 = SparkFun-Resistors:240OHM: 240Ω resistor A resistor is a passive two-terminal electrical component that implements electrical resistance as a circuit element. Resistors act to reduce current flow, and, at the same time, act to lower voltage levels within circuits. - Wikipedia; PROD_ID: RES-07849; VALUE: 240
R36 = SparkFun-Resistors:100KOHM: 100kΩ resistor A resistor is a passive two-terminal electrical component that implements electrical resistance as a circuit element. Resistors act to reduce current flow, and, at the same time, act to lower voltage levels within circuits. - Wikipedia; PROD_ID: RES-07828; VALUE: 100k
RS+ U$40-U$42 = My Stuff:WII_VIA
S1 = JSM08011SAQNR:JSM08011SAQNR: SUB-MINIATURE SLIDE SWITCH Source: Datasheet; ARROW_PART_NUMBER: JSM08011SAQNR; DESCRIPTION: SUB-MINIATURE SLIDE SWITCH; HEIGHT: 2.1mm; MANUFACTURER_NAME: C & K COMPONENTS; MANUFACTURER_PART_NUMBER: JSM08011SAQNR; MOUSER_PART_NUMBER: 611-JSM08011SAQNR; MOUSER_PRICE-STOCK: https://www.mouser.co.uk/ProductDetail/CK/JSM08011SAQNR?qs=LgMIjt8LuD%252BuuitC%252BiJuLQ%3D%3D
U0 = LCD_Driver:STUSB4500
U1 = My Stuff:LM49450SQ/NOPB; MANUFACTURER_PART_NUMBER: LM49450SQNOPB; VENDOR: Texas Instruments
U2 = PIC18F25K42:PIC18F25K42
U3 = My Stuff:XC6204B252MR-G; MANUFACTURER_PART_NUMBER: XC6204B252MRG; VENDOR: Torex Semiconductor
U4 = TS3USB221A:TS3USB221A: DPDT Analog Mux Vcc 2.5 to 3.3V Passes up to 5.5V at 3.3V supply 900MHz BW, 6Ω switch resistance; AVAILABILITY: Unavailable; DESCRIPTION: ESD Protected High-Speed USB 2.0 _480-Mbps_ 1: 2 Multiplexer/Demultiplexer Switch; MF: Texas Instruments; MP: TS3USB221A; PACKAGE: None; PRICE: None
U5 = LD3985G33R:LD3985G33R: None; AVAILABILITY: Unavailable; DESCRIPTION: IC REG LIN 3.3V 150MA TSOT23-5; MF: STMicroelectronics; MP: LD3985G33R; PACKAGE: SOT-23-5 STMicroelectronics; PRICE: None
U6 = Wii_PMS:TPS61232DRCR; BUILT_BY: EMA_UL_Team; COPYRIGHT: Copyright (C) 2018 Accelerated Designs. All rights reserved; MANUFACTURER_PART_NUMBER: TPS61232DRCR; VENDOR: Texas Instruments
U7 = TPS2111APW:TPS2111APW: AUTOSWITCHING POWER MUX; AVAILABILITY: Unavailable; DESCRIPTION: Power Muxes and Current Limited Switches Autoswitching Power Mux; MF: Texas Instruments; MP: TPS2111APW; PACKAGE: TSSOP-8 Texas Instruments; PRICE: None
U8 = bq25895:BQ25895RTWR: Single Cell 5A Fast Charger MaxCharge(TM) Technology for High Input Voltage and 3.1A Boost 24-WQFN -40 to 85; AVAILABILITY: Unavailable; DESCRIPTION: Single Cell 5A Fast Charger MaxCharge_TM_ Technology for High Input Voltage and 3.1A Boost 24-WQFN -40 to 85; MF: Texas Instruments; MP: BQ25895RTWR; PACKAGE: WQFN-24 Texas Instruments; PRICE: None
U9 = WiiSPii:GL82L_SSOP: The GL82L_SSOP package, which is an IC which allows onboard SD card transfer to a USB drive. It also comes in a QFN package.
U10 = drv2603:DRV2603
U$1 U$7 = My Stuff:AUDIO_AMP_PIC
U$2 = Wii PMS:INDUCTOR_SMALL
U$3 U$8 U$18 = My Stuff:1MM_PIC_PROGRAMING_HEADER
U$4 U$5 = My_Stuff:SWITCHSTICK_BREAKOUT
U$6 U$50-U$52 = bq25895:TPS82085
U$9 = WiiSPii:RK10J11R001Y
U$10 = MODULE_LMZM23600SILR:LMZM23601
U$11 U$12 U$16 U$17 = EVQ-P7J01P:EVQ-P7J01P
U$13 = WiiSPii:MOLEX_0541020164MOLEX
U$14 = WiiSPii:MX_WII
U$15 = WiiSPii:TFE20
U$27 U$28 = My Stuff:VOLTAGE_PAD
U$44 = My Stuff:HP_JACK
U$45 U$46 = LCD_Driver:STL6P3LLH6
U$49 = Wii PMS:INDUCTOR_LARGE
Y1 = ECS-120-13-30B-AEM-TR:ECS-120-13-30B-AEM-TR: The ECX-53B is a miniature SMD Crystal with a 3.2 x 5 mm footprint. This package is ideal for todays compact wireless applications where board space is critical.; ARROW_ELECTRONICS-PURCHASE-URL: https://snapeda.com/shop?store=Arrow+Electronics&id=2751400; DESCRIPTION: 12MHz ±25ppm Crystal 13pF 80 Ohms 4-SMD, No Lead; DIGI-KEY_PART_NUMBER: XC2678CT-ND; MF: ECS Inc.; MOUSER-PURCHASE-URL: https://snapeda.com/shop?store=Mouser&id=2751400; MP: ECS-120-13-30B-AEM-TR; PACKAGE: SMD-4 ECS International

## Net classes
1 USB 2.0 Differential Pair: width 0.114 mm